# Altium schematic sheet Block Diagram.SchDoc
size A4; Date: 2026/04/16; ApprovedBy: NA; Author: 邱上峯; CompanyName: JFM常裕富士機工; Engineer: 邱上峯; Revision: V1.0; SheetNumber: 1; SheetTotal: 9; Pcb Name: NA
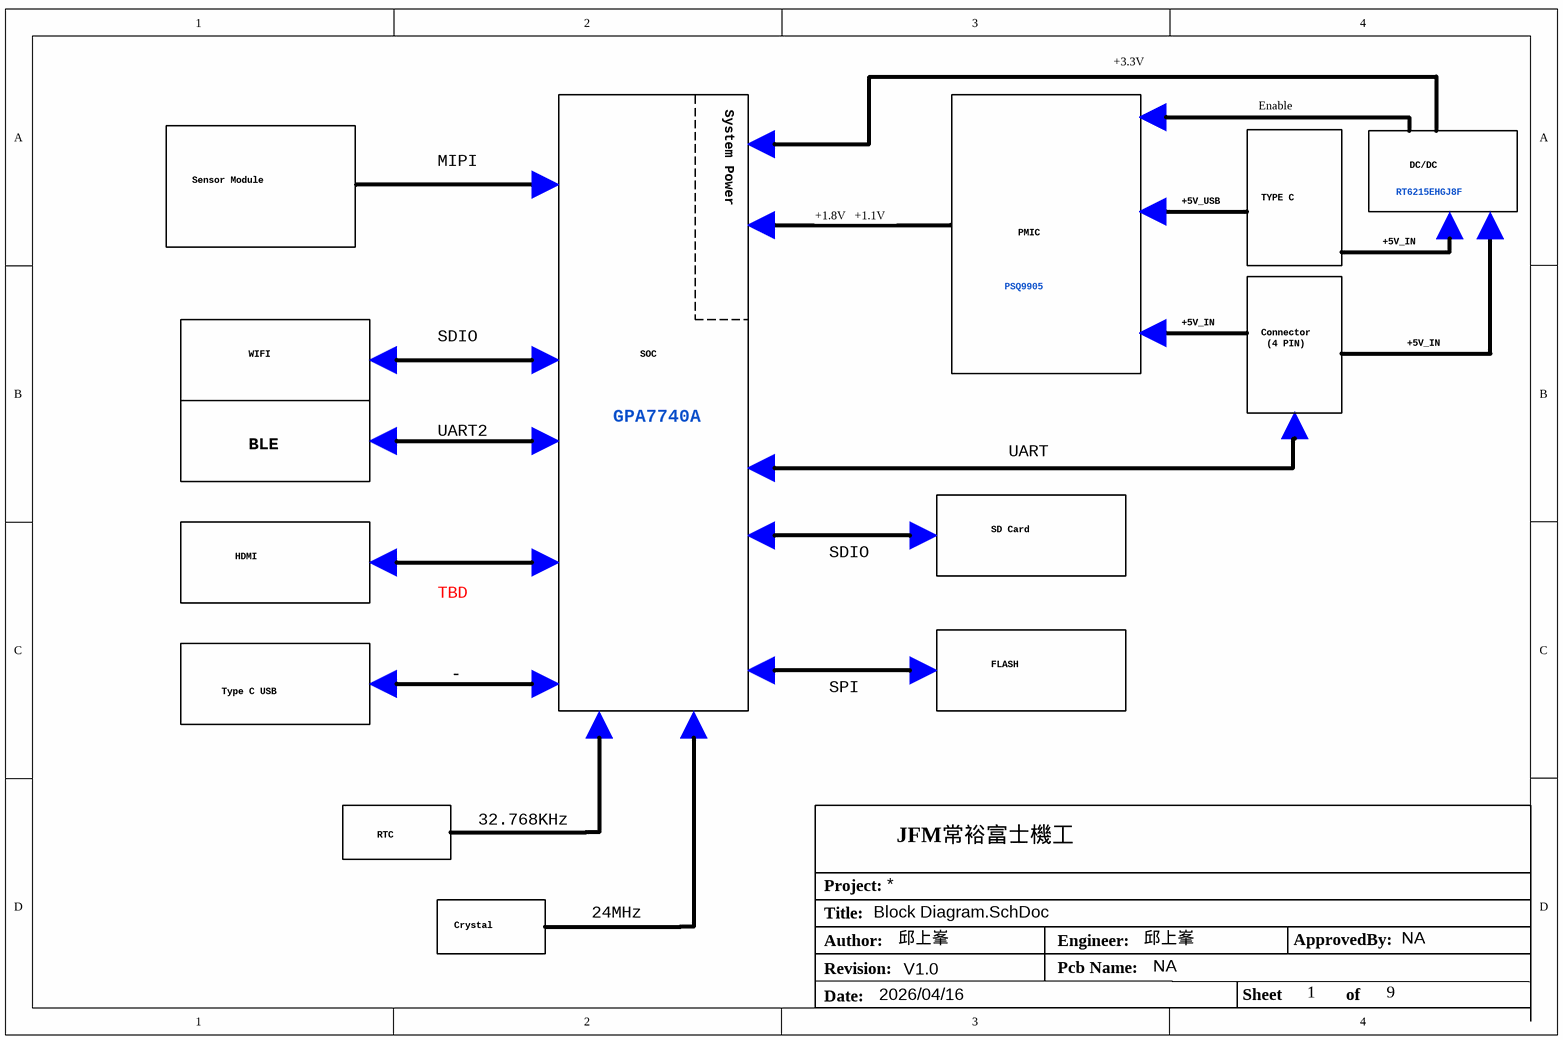
[diagram p0: Block Diagram.SchDoc]

## Notes on the sheet
- System Power
- +3.3V
- Enable
- MIPI
- Sensor Module
- +1.8V   +1.1V
- PMIC
- +5V_USB
- TYPE C
- +5V_IN
- RT6215EHGJ8F
- DC/DC
- PSQ9905
- WIFI
- SDIO
- SOC
- Connector
  (4 PIN)
- BLE
- UART2
- GPA7740A
- UART
- HDMI
- SD Card
- TBD
- Type C USB
- -
- SPI
- FLASH
- RTC
- 32.768KHz
- 24MHz
- Crystal
- Title:
- Project:
- Date:
- Author:
- Revision:
- Engineer:
- Pcb Name:
- Sheet
- ApprovedBy:
- of